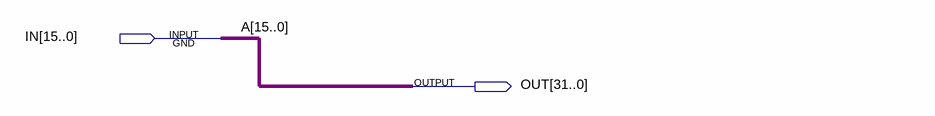
[diagram p0: schematic sheet]
// Quartus schematic signext16_32.bdf as structural Verilog: 0 symbols, 2 pins
module signext16_32 (
  input  [15:0] IN,
  output [31:0] OUT
);


  assign OUT = {{17{IN[15]}}, IN[14:0]};

  // Other names for the same wires on the sheet: A[15:0] = IN
endmodule
